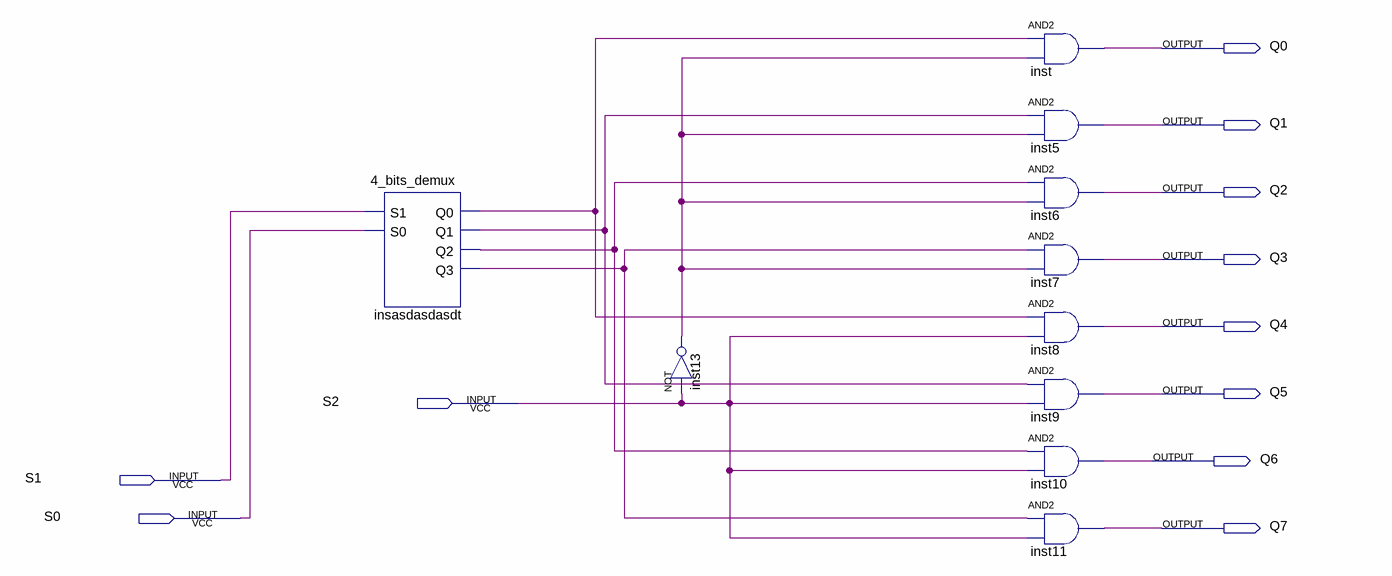
[diagram p0: schematic sheet]
// Quartus schematic 8_bit_demux.bdf as structural Verilog: 10 symbols, 11 pins
module \8_bit_demux  (
  input  S2,
  input  S1,
  input  S0,
  output Q0,
  output Q1,
  output Q2,
  output Q3,
  output Q4,
  output Q5,
  output Q6,
  output Q7
);

  wire insasdasdasdt_q0, insasdasdasdt_q1, insasdasdasdt_q2, insasdasdasdt_q3, inst13_out;

  \4_bits_demux  insasdasdasdt (
    .S1(S1), .S0(S0), .Q0(insasdasdasdt_q0), .Q1(insasdasdasdt_q1), .Q2(insasdasdasdt_q2),
    .Q3(insasdasdasdt_q3));
  not inst13 (inst13_out, S2);
  and inst (Q0, insasdasdasdt_q0, inst13_out);
  and inst5 (Q1, insasdasdasdt_q1, inst13_out);
  and inst6 (Q2, insasdasdasdt_q2, inst13_out);
  and inst7 (Q3, insasdasdasdt_q3, inst13_out);
  and inst8 (Q4, insasdasdasdt_q0, S2);
  and inst9 (Q5, insasdasdasdt_q1, S2);
  and inst10 (Q6, insasdasdasdt_q2, S2);
  and inst11 (Q7, insasdasdasdt_q3, S2);
endmodule
